# Altium schematic sheet Main.SchDoc
size 420 x 297 mm; SheetNumber: 1; SheetTotal: 1
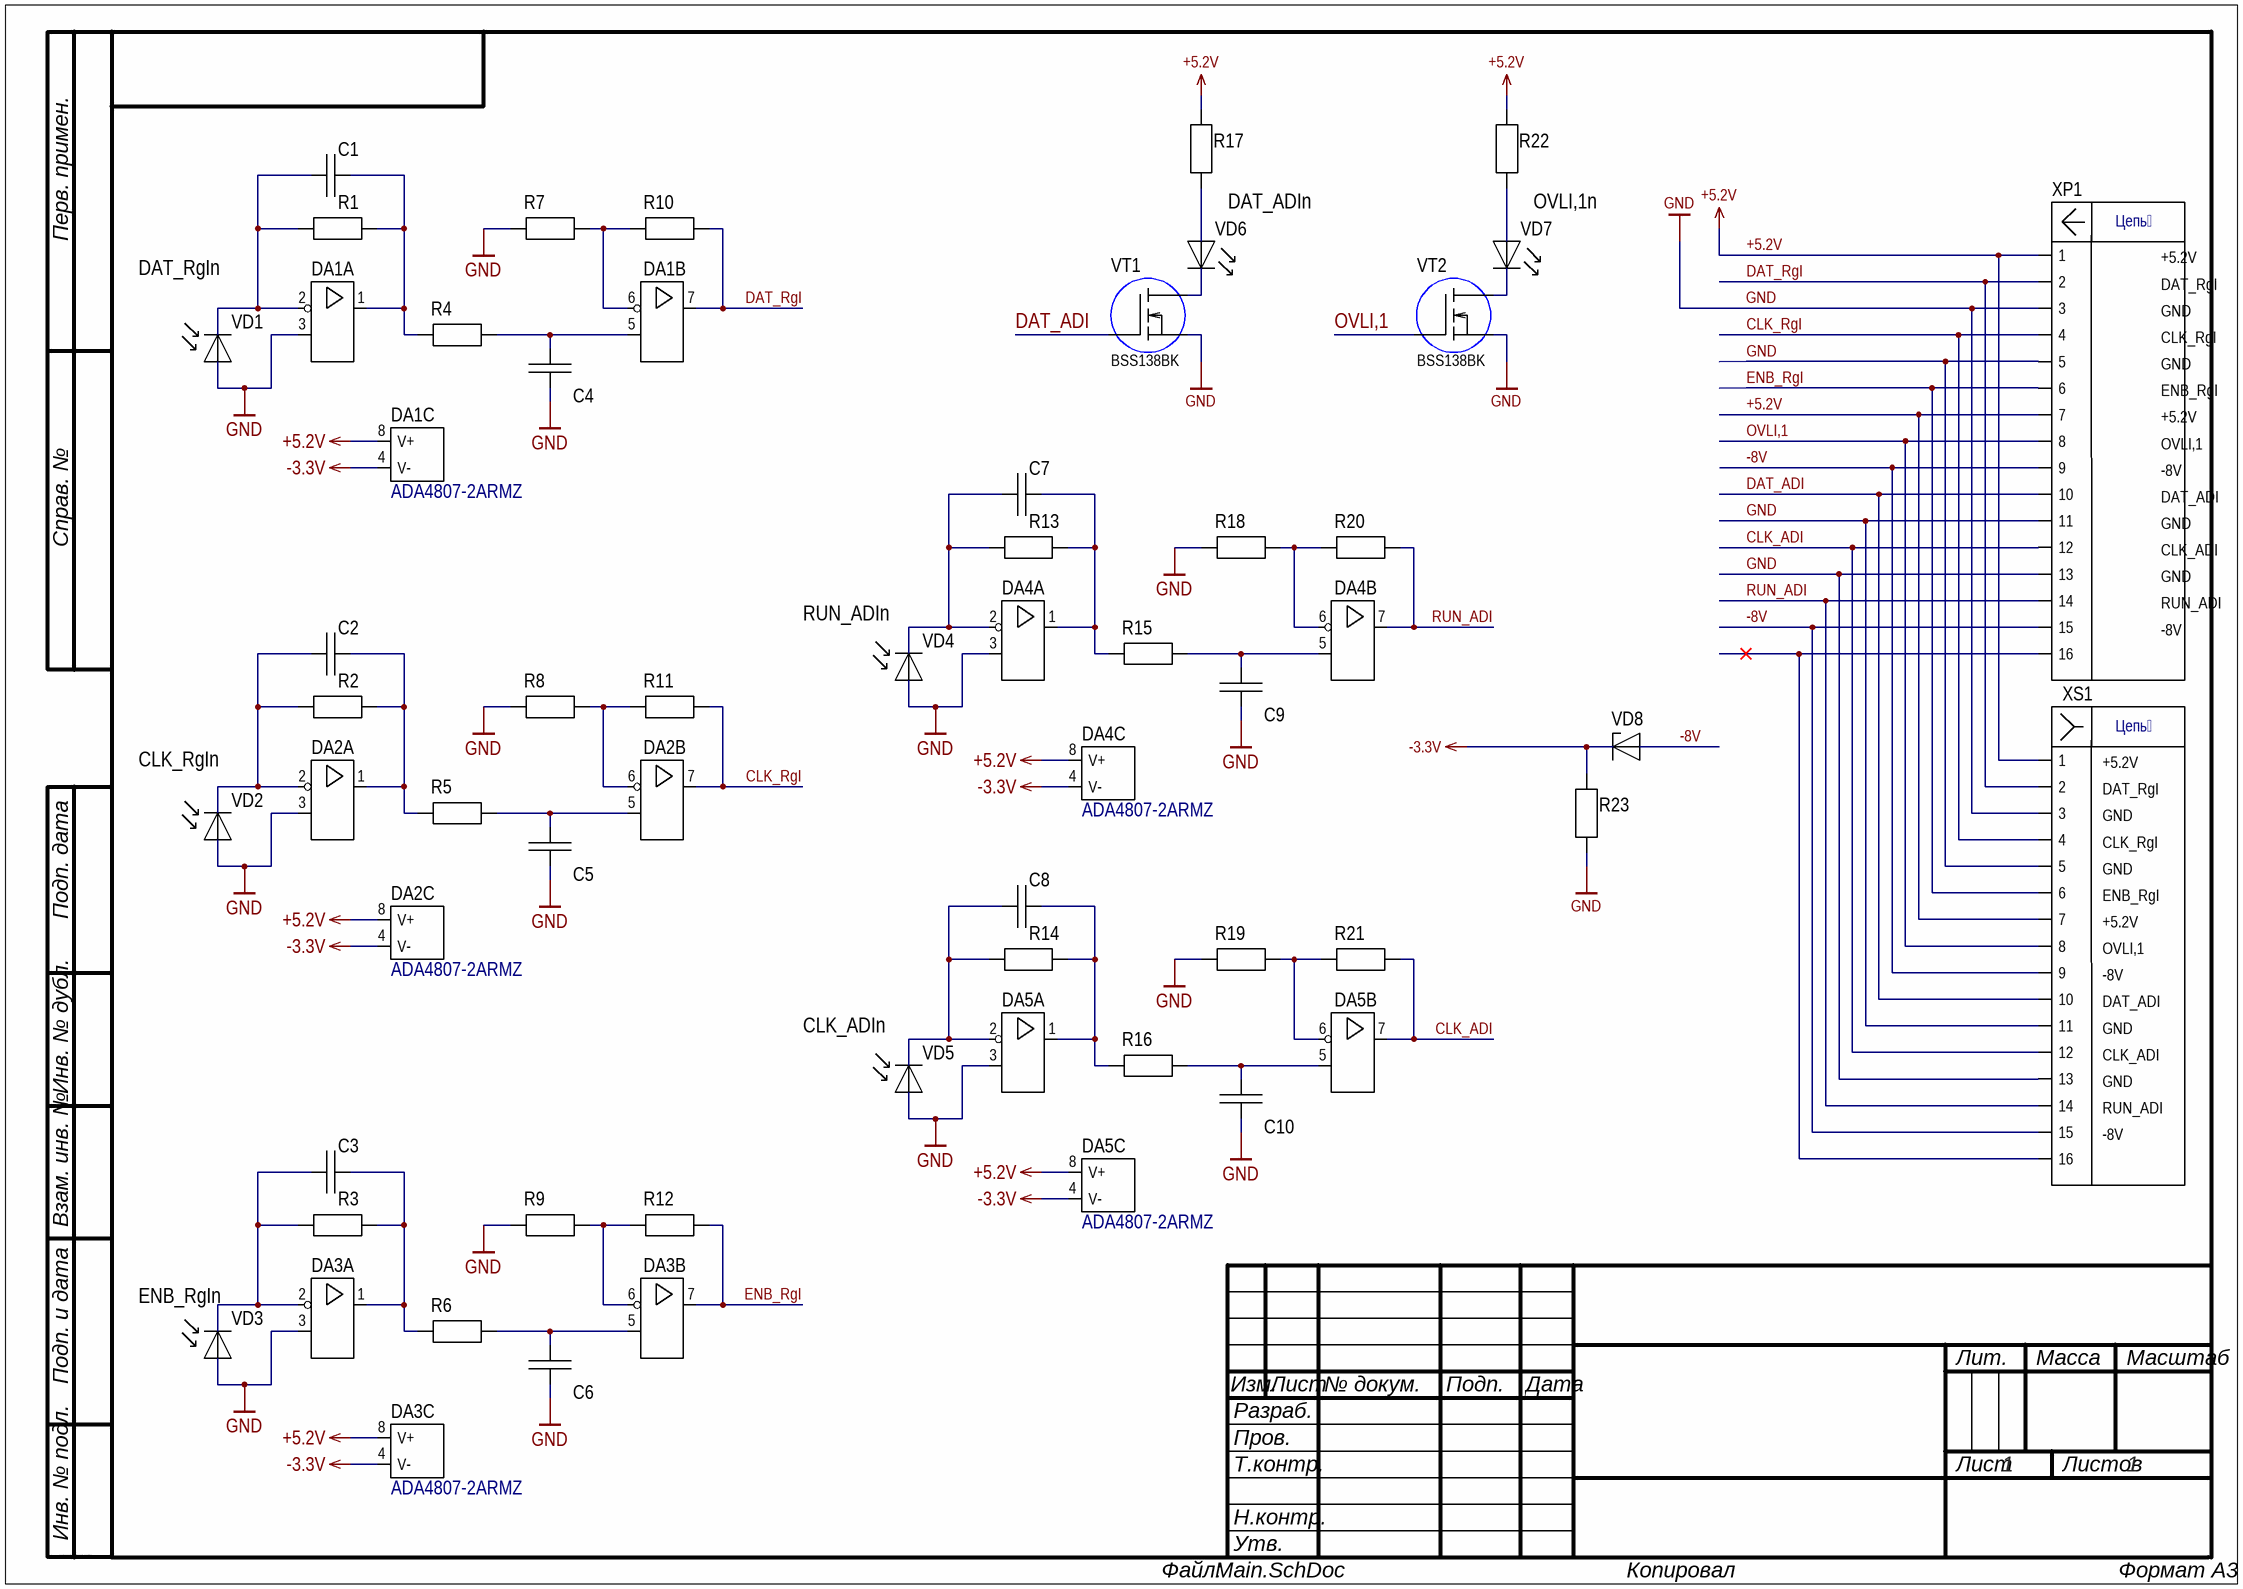
[diagram p0: Main.SchDoc]

## Parts
C1  0805-NP0-50 В-2,4 пФ-1%  [CAP: 0805]  (value not drawn)
C2  0805-NP0-50 В-2,4 пФ-1%  [CAP: 0805]  (value not drawn)
C3  0805-NP0-50 В-2,4 пФ-1%  [CAP: 0805]  (value not drawn)
C4  1206-С0G-50 B-56 пФ+-1%  [CAP: 1206]  (value not drawn)
C5  1206-С0G-50 B-56 пФ+-1%  [CAP: 1206]  (value not drawn)
C6  1206-С0G-50 B-56 пФ+-1%  [CAP: 1206]  (value not drawn)
C7  0805-NP0-50 В-2,4 пФ-1%  [CAP: 0805]  (value not drawn)
C8  0805-NP0-50 В-2,4 пФ-1%  [CAP: 0805]  (value not drawn)
C9  1206-С0G-50 B-56 пФ+-1%  [CAP: 1206]  (value not drawn)
C10  1206-С0G-50 B-56 пФ+-1%  [CAP: 1206]  (value not drawn)
DA1  ADA4807-2ARMZ  [8-MSOP]  (value not drawn)  (parts A,B,C of 3)
DA2  ADA4807-2ARMZ  [8-MSOP]  (value not drawn)  (parts A,B,C of 3)
DA3  ADA4807-2ARMZ  [8-MSOP]  (value not drawn)  (parts A,B,C of 3)
DA4  ADA4807-2ARMZ  [8-MSOP]  (value not drawn)  (parts A,B,C of 3)
DA5  ADA4807-2ARMZ  [8-MSOP]  (value not drawn)  (parts A,B,C of 3)
R1  1206-5,23 кОм+-1%  [1206]  (value not drawn)
R2  1206-5,23 кОм+-1%  [1206]  (value not drawn)
R3  1206-5,23 кОм+-1%  [1206]  (value not drawn)
R4  1206-140 Ом+-1%  [1206]  (value not drawn)
R5  1206-140 Ом+-1%  [1206]  (value not drawn)
R6  1206-140 Ом+-1%  [1206]  (value not drawn)
R7  1206-102 Ом+-1%  [1206]  (value not drawn)
R8  1206-102 Ом+-1%  [1206]  (value not drawn)
R9  1206-102 Ом+-1%  [1206]  (value not drawn)
R10  1206-215 Ом+-1%  [1206]  (value not drawn)
R11  1206-215 Ом+-1%  [1206]  (value not drawn)
R12  1206-215 Ом+-1%  [1206]  (value not drawn)
R13  1206-5,23 кОм+-1%  [1206]  (value not drawn)
R14  1206-5,23 кОм+-1%  [1206]  (value not drawn)
R15  1206-140 Ом+-1%  [1206]  (value not drawn)
R16  1206-140 Ом+-1%  [1206]  (value not drawn)
R17  1206-30 Ом+-5%  [1206]  (value not drawn)
R18  1206-102 Ом+-1%  [1206]  (value not drawn)
R19  1206-102 Ом+-1%  [1206]  (value not drawn)
R20  1206-215 Ом+-1%  [1206]  (value not drawn)
R21  1206-215 Ом+-1%  [1206]  (value not drawn)
R22  1206-30 Ом+-5%  [1206]  (value not drawn)
R23  1206-1 кОм+-5%  [1206]  (value not drawn)
VD1  SFH203  [SFH203]  (value not drawn)
VD2  SFH203  [SFH203]  (value not drawn)
VD3  SFH203  [SFH203]  (value not drawn)
VD4  SFH203  [SFH203]  (value not drawn)
VD5  SFH203  [SFH203]  (value not drawn)
VD6  VSMY2853RG  [VSMY2853G]  (value not drawn)
VD7  VSMY2853RG  [VSMY2853G]  (value not drawn)
VD8  BZX384-C4V7  [SOD-323]  (value not drawn)
VT1  BSS138BK  [SOT-23-3]
VT2  BSS138BK  [SOT-23-3]
XP1  DS1018-02-16B2  [DS1018-02-16B2]  (value not drawn)
XS1  IDC2-16  (value not drawn)

## Nets
+5.2V: DA1.8(V+) DA2.8(V+) DA3.8(V+) DA4.8(V+) DA5.8(V+) R17.2 R22.2 XP1.1 XP1.7 XS1.1 XS1.7
-3.3V: DA1.4(V-) DA2.4(V-) DA3.4(V-) DA4.4(V-) DA5.4(V-) R23.2 VD8.1
GND: C4.1 C5.1 C6.1 C9.1 C10.1 DA1.3(+IN_A) DA2.3(+IN_A) DA3.3(+IN_A) DA4.3(+IN_A) DA5.3(+IN_A) R7.1 R8.1 R9.1 R18.1 R19.1 R23.1 VD1.1 VD2.1 VD3.1 VD4.1 VD5.1 VT1.2(S) VT2.2(S) XP1.3 XP1.5 XP1.11 XP1.13 XS1.3 XS1.5 XS1.11 XS1.13
-8V: VD8.2 XP1.9 XP1.15 XS1.9 XS1.15
CLK_ADI: DA5.7(OUT_B) R21.2 XP1.12 XS1.12
CLK_RgI: DA2.7(OUT_B) R11.2 XP1.4 XS1.4
DAT_ADI: VT1.1(G) XP1.10 XS1.10
DAT_RgI: DA1.7(OUT_B) R10.2 XP1.2 XS1.2
ENB_RgI: DA3.7(OUT_B) R12.2 XP1.6 XS1.6
OVLI,1: VT2.1(G) XP1.8 XS1.8
RUN_ADI: DA4.7(OUT_B) R20.2 XP1.14 XS1.14
NetC1_1: C1.1 DA1.2(-IN_A) R1.1 VD1.2
NetC1_2: C1.2 DA1.1(OUT_A) R1.2 R4.1
NetC2_1: C2.1 DA2.2(-IN_A) R2.1 VD2.2
NetC2_2: C2.2 DA2.1(OUT_A) R2.2 R5.1
NetC3_1: C3.1 DA3.2(-IN_A) R3.1 VD3.2
NetC3_2: C3.2 DA3.1(OUT_A) R3.2 R6.1
NetC4_2: C4.2 DA1.5(+IN_B) R4.2
NetC5_2: C5.2 DA2.5(+IN_B) R5.2
NetC6_2: C6.2 DA3.5(+IN_B) R6.2
NetC7_1: C7.1 DA4.2(-IN_A) R13.1 VD4.2
NetC7_2: C7.2 DA4.1(OUT_A) R13.2 R15.1
NetC8_1: C8.1 DA5.2(-IN_A) R14.1 VD5.2
NetC8_2: C8.2 DA5.1(OUT_A) R14.2 R16.1
NetC9_2: C9.2 DA4.5(+IN_B) R15.2
NetC10_2: C10.2 DA5.5(+IN_B) R16.2
NetDA1_6: DA1.6(-IN_B) R7.2 R10.1
NetDA2_6: DA2.6(-IN_B) R8.2 R11.1
NetDA3_6: DA3.6(-IN_B) R9.2 R12.1
NetDA4_6: DA4.6(-IN_B) R18.2 R20.1
NetDA5_6: DA5.6(-IN_B) R19.2 R21.1
NetR17_1: R17.1 VD6.1(Anode)
NetR22_1: R22.1 VD7.1(Anode)
NetVD6_2: VD6.2(Cathode) VT1.3(D)
NetVD7_2: VD7.2(Cathode) VT2.3(D)
NetXP1_16: XP1.16 XS1.16

## Notes on the sheet
- DAT_ADIn
- OVLI,1n
- (near VD1) DAT_RgIn
- +5.2V
- (near XP1) DAT_RgI
- GND
- (near XP1) CLK_RgI
- (near XP1) ENB_RgI
- OVLI,1
- -8V
- (near XP1) DAT_ADI
- (near XP1) CLK_ADI
- (near VD4) RUN_ADIn
- (near XP1) RUN_ADI
- (near VD2) CLK_RgIn
- (near XS1) +5.2V
- (near XS1) DAT_RgI
- (near XS1) GND
- (near XS1) CLK_RgI
- (near XS1) ENB_RgI
- (near XS1) OVLI,1
- (near XS1) -8V
- (near VD5) CLK_ADIn
- (near XS1) DAT_ADI
- (near XS1) CLK_ADI
- (near XS1) RUN_ADI
- (near VD3) ENB_RgIn
- Перв. примен.
- Справ. №
- Подп. дата
- Инв. № дубл.
- Взам. инв. №
- Подп. и дата
- Изм.
- Разраб.
- Лист
- № докум.
- Подп.
- Дата
- Лит.
- Масса
- Масштаб
- Пров.
- Т.контр.
- Листов
- Инв. № подл.
- Н.контр.
- Утв.
- ALTIUM GOSTBOM2.0 KEV
- Файл:
- Копировал
- Формат А3
- (in symbol DS1018-02-16B2) Цепь
- (in symbol IDC2-16) Цепь

## Library data of the parts
C1-C3 C7 C8 = 0805-NP0-50 В-2,4 пФ-1%: Value: 2,1 мкФ
C4-C6 C9 C10 = 1206-С0G-50 B-56 пФ+-1%: Value: 56 пФ
DA1-DA5 = ADA4807-2ARMZ: 3.1 nV/√Hz, 1 mA, 180 MHz, / Rail-to-Rail Input/Output Amplifiers
R4-R6 R15 R16 = 1206-140 Ом+-1%: Value: 140 Ом; ModelPrint: 1206
R7-R9 R18 R19 = 1206-102 Ом+-1%: Value: 102 Ом; ModelPrint: 1206
R10-R12 R20 R21 = 1206-215 Ом+-1%: Value: 215 Ом; ModelPrint: 1206
R17 R22 = 1206-30 Ом+-5%: Value: 30 Ом; ModelPrint: 1206
R23 = 1206-1 кОм+-5%: Value: 1 кОм; ModelPrint: 1206
VD1-VD5 = SFH203: Silicon PIN Photodiode
VD6 VD7 = VSMY2853RG: High Speed Infrared Emitting Diodes, 850 nm, / Surface Emitter Technology
VT1 VT2 = BSS138BK: 60 V, 360 mA N-channel Trench MOSFET
XP1 = DS1018-02-16B2: pitch 2mm, 20 pin 2x10
XS1 = IDC2-16: DS1017-16MA2
R1-R3 R13 R14 = 1206-5,23 кОм+-1%: ModelPrint: 1206; Value: 5,23 кОм